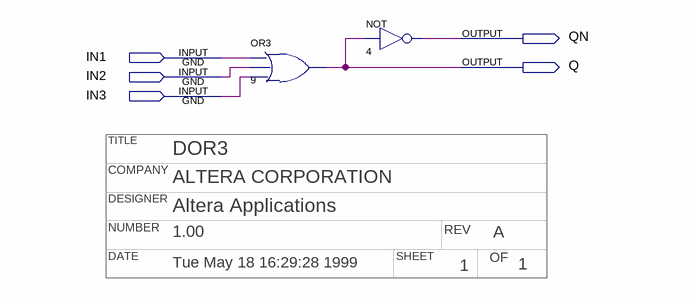
[diagram p0: schematic sheet]
// Quartus schematic dor3.bdf as structural Verilog: 2 symbols, 5 pins
// Title block: TITLE: DOR3; COMPANY: ALTERA CORPORATION; DESIGNER: Altera Applications; NUMBER: 1.00; REV: A; DATE: Tue May 18 16:29:28 1999; SHEET: 1; OF: 1
module dor3 (
  input  IN1,
  input  IN2,
  input  IN3,
  output QN,
  output Q
);

  or u_9 (Q, IN1, IN2, IN3);
  not u_4 (QN, Q);
endmodule
